# Altium project PCB_Project2.PrjPCB
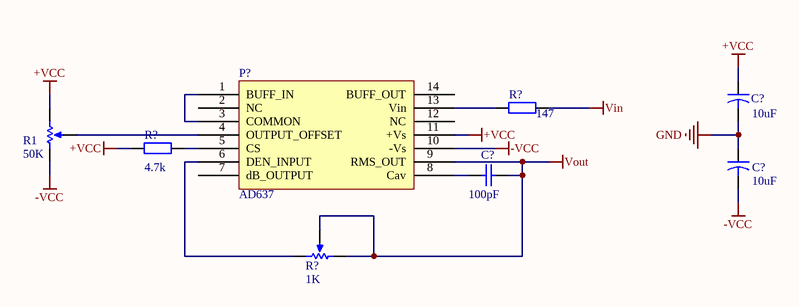
[diagram p0: Sheet3.SchDoc]
1 sheet, 8 parts. Net scope: global (net labels, ports and power ports of the same name join across sheets).
Board file: PCB2.PcbDoc

## Sheet Sheet3.SchDoc
size A3

### Parts
(Parts that share a designator on the sheet are numbered #1, #2 ... from top to bottom, then left to right.)
C?#1  value 10uF  [CAPR5-4X5]  (hidden comment: Cap2)
C?#2  value 100pF  [C1206]  (hidden comment: Cap Semi)
C?#3  value 10uF  [CAPR5-4X5]  (hidden comment: Cap2)
P?  AD637  [DIP14]
R1  value 50K  [VR5]  (hidden comment: RPot)
R?#1  value 147  [AXIAL-0.4]  (hidden comment: Res2)
R?#2  value 4.7k  [AXIAL-0.4]  (hidden comment: Res2)
R?#3  value 1K  [VR5]  (hidden comment: RPot)

### Nets
+VCC: C?#1.1 P?.11(+Vs) R1.2(BOT) R?#2.1
-VCC: C?#3.2 P?.10(-Vs) R1.1(TOP)
GND: C?#1.2 C?#3.1
Vin: R?#1.2
Vout: C?#2.2 P?.9(RMS_OUT) R?#3.1(TOP) R?#3.3(TAP)
NetC?#2_1: C?#2.1 P?.8(Cav)
NetP?_1: P?.1(BUFF_IN) P?.3(COMMON)
NetP?_4: P?.4(OUTPUT_OFFSET) R1.3(TAP)
NetP?_5: P?.5(CS) R?#2.2
NetP?_6: P?.6(DEN_INPUT) R?#3.2(BOT)
NetP?_13: P?.13(Vin) R?#1.1

Not connected (* = marked no-connect by the designer): P? 2(NC) 7(dB_OUTPUT) 12(NC) 14(BUFF_OUT)

### Library data of the parts
C?#1 C?#3 = Cap2: Capacitor; Published: 23-Sep-2002; PackageReference: CAPR5-4X5; Publisher: Altium Limited; PackageDescription: Capacitor; 2 Leads
C?#2 = Cap Semi: Capacitor (Semiconductor SIM Model); Published: 8-Jun-2000; LatestRevisionDate: 29-May-2009; LatestRevisionNote: IPC-7351 Footprint Added.; PackageReference: C1206; Publisher: Altium Limited; PackageDescription: Chip Capacitor
R1 R?#3 = RPot: Potentiometer; Sim Note: Enter the Resistance value and the set point into parameter fields.; Set Position: 0.5; Published: 8-Jun-2000; LatestRevisionDate: 17-Jul-2002; LatestRevisionNote: Re-released for DXP Platform.; PackageReference: VR5; Publisher: Altium Limited; PackageDescription: Variable Resistor, Thru-Hole; 3 Leads
R?#1 R?#2 = Res2: Resistor; Published: 8-Jun-2000; LatestRevisionDate: 17-Jul-2002; LatestRevisionNote: Re-released for DXP Platform.; PackageReference: AXIAL-0.4; Publisher: Altium Limited; PackageDescription: Axial Device, Thru-Hole; 2 Leads; 0.4 in Pin Spacing